# Altium schematic sheet Power.SchDoc: Power
size A4; SheetSize: A4
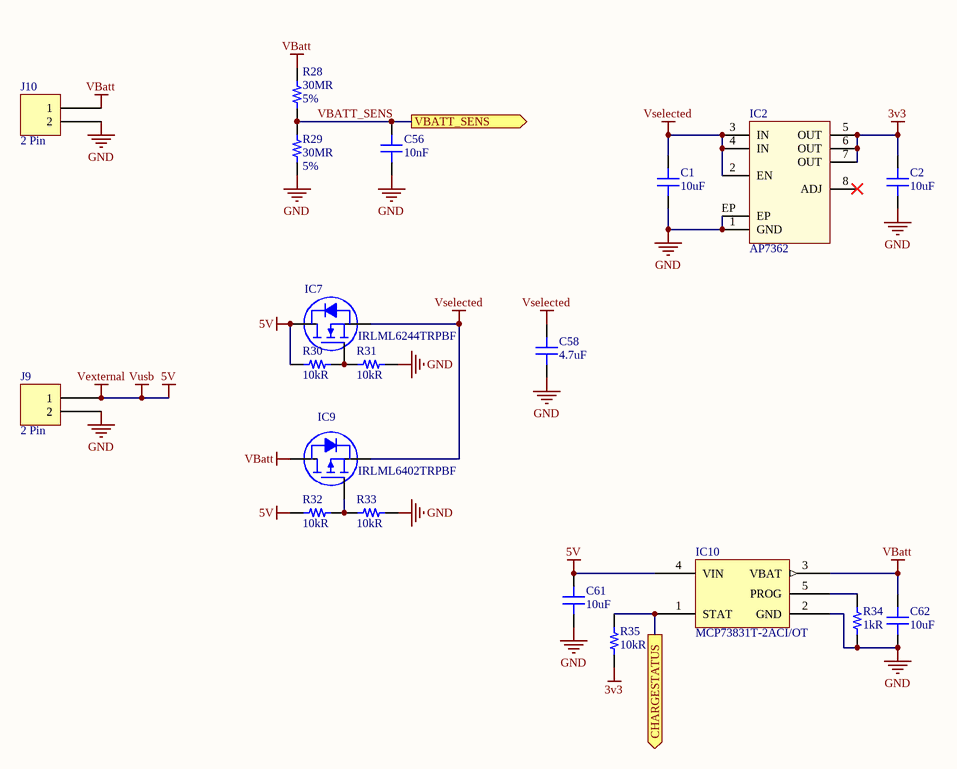
[diagram p0: Power.SchDoc]

## Parts
C1  10uF  [CAP 0603/1608]
C2  10uF  [CAP 0603/1608]
C56  10nF  [CAP 0603/1608]
C58  4.7uF  [CAP 0603/1608]
C61  10uF  [CAP 0603/1608]
C62  10uF  [CAP 0603/1608]
IC2  AP7362  [DIODES SO-8-EP]
IC7  IRLML6244TRPBF  [INFINEON SOT-23-3]
IC9  IRLML6402TRPBF  [INFINEON SOT-23-3]
IC10  MCP73831T-2ACI/OT  [MICROCHIP SOT-23-5 OT]
J9  2 Pin  [JST XH B2B-XH-A]
J10  2 Pin  [JST XH B2B-XH-A]
R28  30MR  Tolerance: 5%  [RES 0603/1608]
R29  30MR  Tolerance: 5%  [RES 0603/1608]
R30  10kR  [RES 0603/1608]
R31  10kR  [RES 0603/1608]
R32  10kR  [RES 0603/1608]
R33  10kR  [RES 0603/1608]
R34  1kR  [RES 0603/1608]
R35  10kR  [RES 0603/1608]

## Ports
CHARGESTATUS (out), VBATT_SENS (out)

## Nets
3v3: C2.2 IC2.5(OUT) IC2.6(OUT) IC2.7(OUT) R35.1
5V: C61.2 IC7.3(D) IC10.4(VIN) J9.1 R30.2 R32.2  [also labelled Vexternal, Vusb]
GND: C1.1 C2.1 C56.1 C58.1 C61.1 C62.1 IC2.1(GND) IC2.EP IC10.2(GND) J9.2 J10.2 R29.1 R31.1 R33.1 R34.1
VBatt: C62.2 IC9.3(D) IC10.3(VBAT) J10.1 R28.2
Vselected: C1.2 C58.2 IC2.2(EN) IC2.3(IN) IC2.4(IN) IC7.2(S) IC9.2(S)
CHARGESTATUS: IC10.1(STAT) R35.2 ; port CHARGESTATUS
VBATT_SENS: C56.2 R28.1 R29.2 ; port VBATT_SENS
NetIC7_1: IC7.1(G) R30.1 R31.2
NetIC9_1: IC9.1(G) R32.1 R33.2
NetIC10_5: IC10.5(PROG) R34.2

Not connected (* = marked no-connect by the designer): IC2 8(ADJ)*

## Notes on the sheet
- Title:
- Size:
- Project:
- Revision:
- Sheet
- of
- Date:
- YıLDıZ IoT
- Elperek Mahallesi
- Saray Sokak, No:12
- SAKARYA / TURKEY
- File:

## Library data of the parts
C1 C2 C61 C62 = Capacitor - Ceramic: Ceramic, SMT Capacitor; Manufacturer: Samsung; Manufacturer Part Number: CL10A106MQ8NNNC; Tolerance: 20%; Voltage Rating: 6.3V; Dielectric: X5R; Supplier 1: Digi-Key; Supplier Part Number 1: 1276-1119-1-ND; Stock 1: 4408315; Pricing 1: 1 = 0,15000, 10 = 0,11000, 100 = 0,05150, 500 = 0,03614, 1000 = 0,02992 (USD); RoHS: Yes; Mount: Surface Mount; Case/Package: 0603; Case Code (Metric): 1608; Case Code (Imperial): 0603; Contact Plating: Tin; Min Operating Temperature: -55°C; Max Operating Temperature: 85°C; Package Quantity: 1; Packaging: Tape and Reel; Capacitance: 10uF; Voltage: 6.3V; Length: 1.6mm; Height: 0.8mm; Width: 0.031inch; Thickness: 0.035inch; Depth: 0.8mm; Radiation Hardening: No; ComponentLink1URL: https://datasheet.ciiva.com/25798/cl10a106mq8nnnc-25798320.pdf?src-supplier=Digi-Key; ComponentLink1Description: https://datasheet.ciiva.com/25798/cl10a106mq8nnnc-25798320.pdf?src-supplier=Digi-Key; ComponentLink2URL: https://datasheet.ciiva.com/26838/getdatasheetpartid-357557-26838347.pdf?src-supplier=Verical; ComponentLink2Description: https://datasheet.ciiva.com/26838/getdatasheetpartid-357557-26838347.pdf?src-supplier=Verical; ComponentLink3URL: https://datasheet.ciiva.com/16437/cl05b104kq5nnnc-16437327.pdf?src-supplier=Future+Electronics; ComponentLink3Description: https://datasheet.ciiva.com/16437/cl05b104kq5nnnc-16437327.pdf?src-supplier=Future+Electronics
C56 = Capacitor - Ceramic: Ceramic, SMT Capacitor; Manufacturer: KEMET; Manufacturer Part Number: C0603C103J5RACTU; Dielectric: X7R; Tolerance: 5%; Supplier 1: Digi-Key; Supplier Part Number 1: 399-1092-1-ND; Stock 1: 659548; Pricing 1: 1 = 0,10000, 10 = 0,05300, 100 = 0,02360, 500 = 0,01682, 1000 = 0,01322 (USD); RoHS: Yes; Mount: Surface Mount; Case/Package: 0603; Min Operating Temperature: -55°C; Max Operating Temperature: 125°C; Capacitance: 10nF; Packaging: Tape and Reel; Length: 1.6mm; Height: 0.8mm; Depth: 0.8mm; Radiation Hardening: No; ComponentLink1URL: https://datasheet.ciiva.com/22749/kem-c1002-x7r-smd-22749720.pdf?src-supplier=Element14; ComponentLink1Description: https://datasheet.ciiva.com/22749/kem-c1002-x7r-smd-22749720.pdf?src-supplier=Element14; ComponentLink2URL: https://datasheet.ciiva.com/26847/getdatasheetpartid-317400-26847516.pdf?src-supplier=Verical; ComponentLink2Description: https://datasheet.ciiva.com/26847/getdatasheetpartid-317400-26847516.pdf?src-supplier=Verical
C58 = Capacitor - Ceramic: Ceramic, SMT Capacitor; Manufacturer: Samsung; Manufacturer Part Number: CL10A475MQ8NNNC; Tolerance: 20%; Voltage Rating: 6.3V; Dielectric: X5R; Supplier 1: Digi-Key; Supplier Part Number 1: 1276-1907-1-ND; Stock 1: 764729; Pricing 1: 1 = 0,10000, 10 = 0,06300, 100 = 0,02790, 500 = 0,01990, 1000 = 0,01564 (USD); RoHS: Yes; Mount: Surface Mount; Case/Package: 0603; Case Code (Metric): 1608; Case Code (Imperial): 0603; Min Operating Temperature: -55°C; Max Operating Temperature: 85°C; Capacitance: 4.7uF; Packaging: Tape and Reel; Package Quantity: 4000; Voltage Rating (DC): 6.3V; Length: 1.6mm; Height: 0.8mm; Width: 0.031inch; Thickness: 0.035inch; Depth: 0.8mm; Radiation Hardening: No; Lead Free: Lead Free; ComponentLink1URL: https://datasheet.ciiva.com/25713/cl10a475mq8nnnc-25713301.pdf?src-supplier=Digi-Key; ComponentLink1Description: https://datasheet.ciiva.com/25713/cl10a475mq8nnnc-25713301.pdf?src-supplier=Digi-Key; ComponentLink2URL: https://datasheet.ciiva.com/26838/getdatasheetpartid-358407-26838391.pdf?src-supplier=Verical; ComponentLink2Description: https://datasheet.ciiva.com/26838/getdatasheetpartid-358407-26838391.pdf?src-supplier=Verical; ComponentLink3URL: https://datasheet.ciiva.com/16437/cl05b104kq5nnnc-16437323.pdf?src-supplier=Future+Electronics; ComponentLink3Description: https://datasheet.ciiva.com/16437/cl05b104kq5nnnc-16437323.pdf?src-supplier=Future+Electronics
IC2 = DIODES AP7362: The AP7362 is a 1.5A adjustable output voltage linear regulator with ultra-low dropout.; Manufacturer: Diodes; Manufacturer Part Number: AP7362-33SP-13; Output Voltage: 3.3V; Number of Regulators: 1; Output Type: Fixed; Polarity: Positive; Accuracy: 3.5%; Quiescent Current: 25nA; Min Input Voltage: 2.2V; Max Input Voltage: 5.5V; Supplier 1: Digi-Key; Supplier Part Number 1: AP7362-33SP-13DICT-ND; Stock 1: 2958; Pricing 1: 1 = 0,51000, 10 = 0,43600, 25 = 0,40640, 100 = 0,30200, 250 = 0,25552, 500 = 0,24392, 1000 = 0,18003 (USD); RoHS: Yes; Mount: Surface Mount; Case/Package: SOP; Number of Pins: 8; Contact Plating: Tin; Min Operating Temperature: -40°C; Max Operating Temperature: 85°C; Packaging: Tape and Reel; Output Current: 1.5A; Number of Outputs: 1; Max Output Current: 1.5A; ComponentLink1URL: http://www.mouser.com/ds/2/115/AP7362-476331.pdf?src-supplier=Mouser; ComponentLink1Description: http://www.mouser.com/ds/2/115/AP7362-476331.pdf?src-supplier=Mouser; ComponentLink2URL: https://www.diodes.com/assets/Datasheets/AP7362.pdf?src-supplier=Digi-Key; ComponentLink2Description: https://www.diodes.com/assets/Datasheets/AP7362.pdf?src-supplier=Digi-Key; ComponentLink3URL: http://diodes.com/datasheets/AP7362.pdf?src-supplier=Avnet; ComponentLink3Description: http://diodes.com/datasheets/AP7362.pdf?src-supplier=Avnet
IC7 = IRLML6244TRPBF: MOSFET N-CH 20V 6.3A SOT-23; Manufacturer: International Rectifier; Threshold Voltage: 900mV; Rds On Max: 21mR; Input Capacitance: 700pF; Max Power Dissipation: 1.3W; Gate to Source Voltage (Vgs): 12V; Turn-On Delay Time: 4.9ns; Turn-Off Delay Time: 19ns; Fall Time: 12ns; Rise Time: 7.5ns; Recovery Time: 18ns; Number of Elements: 1; Element Configuration: Single; On-State Resistance: 27MR; ComponentLink1Description: Datasheet; ComponentLink1URL: https://www.infineon.com/dgdl/irlml6244pbf.pdf?fileId=5546d462533600a4015356686fed261f; ComponentLink2Description: DigiKey Link; ComponentLink2URL: http://digikey.com/product-detail/en/infineon-technologies/IRLML6244TRPBF/IRLML6244TRPBFCT-ND/2393877; Supplier 1: Digi-Key; Supplier Part Number 1: IRLML6244TRPBFCT-ND; Manufacturer Part Number: IRLML6244TRPBF; Stock 1: 35650; Pricing 1: 1 = 0,36000, 10 = 0,29400, 25 = 0,26880, 100 = 0,16880, 250 = 0,16688, 500 = 0,15626, 1000 = 0,10625 (USD); RoHS: Yes; Mount: Surface Mount; Case/Package: SOT-23; Number of Pins: 3; Min Operating Temperature: -55°C; Max Operating Temperature: 150°C; Continuous Drain Current (ID): 6.3A; Packaging: Tape and Reel; Drain to Source Voltage (Vdss): 20V; Drain to Source Breakdown Voltage: 20V; Package Quantity: 3000; Drain to Source Resistance: 21mR; Power Dissipation: 1.3W; Nominal Vgs: 12V; Length: 3.04mm; Height: 1.02mm; Width: 1.4mm; Radiation Hardening: No; Lead Free: Lead Free; REACH SVHC: No SVHC; ComponentLink3URL: https://datasheet.ciiva.com/7935/irlml6244pbf-7935686.pdf?src-supplier=Element14; ComponentLink3Description: https://datasheet.ciiva.com/7935/irlml6244pbf-7935686.pdf?src-supplier=Element14; ComponentLink4URL: https://datasheet.ciiva.com/6369/irlml6244pbf-6369001.pdf?src-supplier=Digi-Key; ComponentLink4Description: https://datasheet.ciiva.com/6369/irlml6244pbf-6369001.pdf?src-supplier=Digi-Key; ComponentLink5URL: https://datasheet.ciiva.com/6369/irlml6244pbf-6369003.pdf?src-supplier=Digi-Key; ComponentLink5Description: https://datasheet.ciiva.com/6369/irlml6244pbf-6369003.pdf?src-supplier=Digi-Key; ComponentLink6URL: https://datasheet.ciiva.com/6369/irlml6244pbf-6369005.pdf?src-supplier=Digi-Key; ComponentLink6Description: https://datasheet.ciiva.com/6369/irlml6244pbf-6369005.pdf?src-supplier=Digi-Key; ComponentLink7URL: https://datasheet.ciiva.com/29325/161189-da-01-en-mosfet-irlml6244trpbf-sot23-ir-29325543.pdf?src-supplier=Conrad; ComponentLink7Description: https://datasheet.ciiva.com/29325/161189-da-01-en-mosfet-irlml6244trpbf-sot23-ir-29325543.pdf?src-supplier=Conrad
IC9 = IRLML6402TRPBF: MOSFET P-CH 20V 3.7A SOT-23; Manufacturer: International Rectifier; Gate to Source Voltage (Vgs): 12V; Drain to Source Resistance: 65mR; Power Dissipation: 1.3W; Turn-On Delay Time: 350ns; Turn-Off Delay Time: 588ns; Fall Time: 381ns; Voltage Rating (DC): -20V; Current Rating: -3.7A; Threshold Voltage: -550mV; Rise Time: 48ns; Input Capacitance: 633pF; Number of Elements: 1; Element Configuration: Single; ComponentLink1Description: Datasheet; ComponentLink1URL: https://www.infineon.com/dgdl/irlml6402pbf.pdf?fileId=5546d462533600a401535668d5c2263c; ComponentLink2Description: DigiKey Link; ComponentLink2URL: http://digikey.com/product-detail/en/infineon-technologies/IRLML6402TRPBF/IRLML6402PBFCT-ND/812500; Supplier 1: Digi-Key; Supplier Part Number 1: IRLML6402PBFCT-ND; Manufacturer Part Number: IRLML6402TRPBF; Stock 1: 132544; Pricing 1: 1 = 0,36000, 10 = 0,28800, 25 = 0,26360, 100 = 0,16550, 250 = 0,16368, 500 = 0,15326, 1000 = 0,10421 (USD); RoHS: Yes; Mount: Surface Mount; Case/Package: SOT-23; Number of Pins: 3; Min Operating Temperature: -55°C; Max Operating Temperature: 150°C; Drain to Source Voltage (Vdss): 20V; Continuous Drain Current (ID): 3.7A; Termination: SMD/SMT; Package Quantity: 1; On-State Resistance: 65mR; Packaging: Tape and Reel; Nominal Vgs: -550mV; Rds On Max: 65mR; Max Power Dissipation: 1.3W; Dual Supply Voltage: -20V; Drain to Source Breakdown Voltage: -20V; Length: 3.04mm; Height: 1.02mm; Width: 1.4mm; Radiation Hardening: No; Lead Free: Lead Free; REACH SVHC: No SVHC; ComponentLink3URL: https://datasheet.ciiva.com/34302/1563729-34302500.pdf?src-supplier=Jameco; ComponentLink3Description: https://datasheet.ciiva.com/34302/1563729-34302500.pdf?src-supplier=Jameco; ComponentLink4URL: https://datasheet.ciiva.com/7333/irlml6402-7333200.pdf?src-supplier=Newark; ComponentLink4Description: https://datasheet.ciiva.com/7333/irlml6402-7333200.pdf?src-supplier=Newark; ComponentLink5URL: https://datasheet.ciiva.com/28515/irlml6402pbf-28515795.pdf?src-supplier=Element14; ComponentLink5Description: https://datasheet.ciiva.com/28515/irlml6402pbf-28515795.pdf?src-supplier=Element14; ComponentLink6URL: https://datasheet.ciiva.com/7799/13209-7799017.pdf?src-supplier=Element14; ComponentLink6Description: https://datasheet.ciiva.com/7799/13209-7799017.pdf?src-supplier=Element14; ComponentLink7URL: https://datasheet.ciiva.com/29326/162833-da-01-en-irlml-6402tr-29326798.pdf?src-supplier=Conrad; ComponentLink7Description: https://datasheet.ciiva.com/29326/162833-da-01-en-irlml-6402tr-29326798.pdf?src-supplier=Conrad; ComponentLink8URL: https://datasheet.ciiva.com/936/irlml6402pbf-936987.pdf?src-supplier=Digi-Key; ComponentLink8Description: https://datasheet.ciiva.com/936/irlml6402pbf-936987.pdf?src-supplier=Digi-Key; ComponentLink9URL: https://datasheet.ciiva.com/16311/irlml6402pbf-16311535.pdf?src-supplier=Future+Electronics; ComponentLink9Description: https://datasheet.ciiva.com/16311/irlml6402pbf-16311535.pdf?src-supplier=Future+Electronics
IC10 = MICROCHIP MCP73831: Miniature Single-Cell, Fully integrated Li-Ion, Li-Polymer charge management controllers; Supplier 1: Digi-Key; Supplier Part Number 1: MCP73831T-2ACI/OTCT-ND; Manufacturer: Microchip; Manufacturer Part Number: MCP73831T-2ACI/OT; Stock 1: 29869; Pricing 1: 1 = 0,56000, 25 = 0,47000, 100 = 0,42000 (USD); RoHS: Yes; ComponentLink1URL: https://datasheet.ciiva.com/22828/0900766b80d2b53a-22828876.pdf?src-supplier=RSComponents; ComponentLink1Description: https://datasheet.ciiva.com/22828/0900766b80d2b53a-22828876.pdf?src-supplier=RSComponents; ComponentLink2URL: https://datasheet.ciiva.com/26344/651521-da-01-en-contr-mcp73831t-2aci-ot-sot-23-5-mcp-26344458.pdf?src-supplier=Conrad; ComponentLink2Description: https://datasheet.ciiva.com/26344/651521-da-01-en-contr-mcp73831t-2aci-ot-sot-23-5-mcp-26344458.pdf?src-supplier=Conrad; ComponentLink3URL: https://datasheet.ciiva.com/1931/21984e-1931953.pdf?src-supplier=Digi-Key; ComponentLink3Description: https://datasheet.ciiva.com/1931/21984e-1931953.pdf?src-supplier=Digi-Key; ComponentLink4URL: https://datasheet.ciiva.com/1931/21984e-1931954.pdf?src-supplier=Digi-Key; ComponentLink4Description: https://datasheet.ciiva.com/1931/21984e-1931954.pdf?src-supplier=Digi-Key; ComponentLink5URL: https://datasheet.ciiva.com/1137/630369-1137803.pdf?src-supplier=Element14; ComponentLink5Description: https://datasheet.ciiva.com/1137/630369-1137803.pdf?src-supplier=Element14; ComponentLink6URL: https://datasheet.ciiva.com/1144/630369-1144461.pdf?src-supplier=Newark; ComponentLink6Description: https://datasheet.ciiva.com/1144/630369-1144461.pdf?src-supplier=Newark; ComponentLink7URL: https://datasheet.ciiva.com/1931/21984e-1931955.pdf?src-supplier=Digi-Key; ComponentLink7Description: https://datasheet.ciiva.com/1931/21984e-1931955.pdf?src-supplier=Digi-Key; ComponentLink8URL: https://datasheet.ciiva.com/28626/630369-28626439.pdf?src-supplier=Element14; ComponentLink8Description: https://datasheet.ciiva.com/28626/630369-28626439.pdf?src-supplier=Element14; ComponentLink9URL: https://datasheet.ciiva.com/3213/21984e-3213404.pdf?src-supplier=Avnet; ComponentLink9Description: https://datasheet.ciiva.com/3213/21984e-3213404.pdf?src-supplier=Avnet; ComponentLink10URL: https://datasheet.ciiva.com/46385/630369-46385324.pdf?src-supplier=Element14; ComponentLink10Description: https://datasheet.ciiva.com/46385/630369-46385324.pdf?src-supplier=Element14
R28 R29 = Resistor_Chip: Ceramic, SMT Capacitor; Manufacturer: Vishay Dale; Manufacturer Part Number: CRCW060330M0JPEAHR; Max Power Dissipation: 100mW; Temperature Coefficient: 500ppm/°C; Supplier 1: Digi-Key; Supplier Part Number 1: 541-30MAHCT-ND; Stock 1: 39597; Pricing 1: 1 = 0,40000, 10 = 0,28500, 100 = 0,11390, 1000 = 0,05610, 2500 = 0,05198 (USD); RoHS: Yes; Case/Package: 0603; Case Code (Imperial): 0603; Contact Plating: Tin; Case Code (Metric): 1608; Min Operating Temperature: -55°C; Max Operating Temperature: 155°C; Resistance: 30MR; Package Quantity: 5000; Packaging: Tape and Reel; Composition: Thick Film; Number of Terminations: 2; Length: 0.061inch; Height: 0.02inch; Width: 0.033inch; Radiation Hardening: No; ComponentLink1URL: https://datasheet.ciiva.com/6566/dcrcwhe3-6566118.pdf?src-supplier=Digi-Key; ComponentLink1Description: https://datasheet.ciiva.com/6566/dcrcwhe3-6566118.pdf?src-supplier=Digi-Key; ComponentLink2URL: https://datasheet.ciiva.com/6566/dcrcwhe3-6566121.pdf?src-supplier=Digi-Key; ComponentLink2Description: https://datasheet.ciiva.com/6566/dcrcwhe3-6566121.pdf?src-supplier=Digi-Key; ComponentLink3URL: https://datasheet.ciiva.com/6566/dcrcwhe3-6566124.pdf?src-supplier=Digi-Key; ComponentLink3Description: https://datasheet.ciiva.com/6566/dcrcwhe3-6566124.pdf?src-supplier=Digi-Key
R30-R33 R35 = Resistor_Chip: Ceramic, SMT Capacitor; Manufacturer: Stackpole Electronics; Manufacturer Part Number: RNCP0603FTD10K0; Tolerance: 1%; Max Power Dissipation: 125mW; Temperature Coefficient: 100ppm/°C; Supplier 1: Digi-Key; Supplier Part Number 1: RNCP0603FTD10K0CT-ND; Stock 1: 183083; Pricing 1: 1 = 0,10000, 10 = 0,06700, 100 = 0,02730, 1000 = 0,01224, 2500 = 0,01063 (USD); RoHS: Yes; Mount: Surface Mount; Case/Package: 0603; Case Code (Metric): 1608; Case Code (Imperial): 0603; Contact Plating: Matte,Tin; Min Operating Temperature: -55°C; Max Operating Temperature: 155°C; Packaging: Tape and Reel; Resistance: 10kR; Composition: Thin Film; Number of Terminations: 2; Features: Anti-Sulfur,Moisture Resistant; Length: 0.059inch; Height: 0.02inch; Width: 0.031inch; Radiation Hardening: No; Lead Free: Lead Free
R34 = Resistor_Chip: Ceramic, SMT Capacitor; Manufacturer: Rohm; Manufacturer Part Number: ESR03EZPJ102; Tolerance: 5%; Temperature Coefficient: 200ppm/°C; Max Power Dissipation: 250mW; Supplier 1: Digi-Key; Supplier Part Number 1: RHM1.0KDCT-ND; Stock 1: 148117; Pricing 1: 1 = 0,10000, 10 = 0,08300, 100 = 0,03180, 1000 = 0,01398, 2500 = 0,01207 (USD); RoHS: Yes; Case/Package: 0603; Case Code (Metric): 1608; Case Code (Imperial): 0603; Min Operating Temperature: -55°C; Max Operating Temperature: 155°C; Resistance: 1kR; Package Quantity: 1; Packaging: Tape and Reel; Composition: Thick Film; Number of Terminations: 2; Features: Automotive AEC-Q200; Length: 0.063inch; Height: 0.022inch; Width: 0.031inch; Lead Free: Lead Free; ComponentLink1URL: https://datasheet.ciiva.com/2469/esr-2469603.pdf?src-supplier=Digi-Key; ComponentLink1Description: https://datasheet.ciiva.com/2469/esr-2469603.pdf?src-supplier=Digi-Key; ComponentLink2URL: https://datasheet.ciiva.com/2469/esr-2469604.pdf?src-supplier=Digi-Key; ComponentLink2Description: https://datasheet.ciiva.com/2469/esr-2469604.pdf?src-supplier=Digi-Key; ComponentLink3URL: https://datasheet.ciiva.com/2469/esr-2469605.pdf?src-supplier=Digi-Key; ComponentLink3Description: https://datasheet.ciiva.com/2469/esr-2469605.pdf?src-supplier=Digi-Key